# Altium schematic sheet RelayDriver.SchDoc
size A4 portrait; DateDraw: Date Draw; DateChecked: Date Review; Workspace: Workspace; TitleTyp: Title-Typ; PageSetup: Record=PageOptions|CenterHorizontal=True|CenterVertical=True|PrintScale=0.97|XCorrection=1.00|YCorrection=1.00|PrintKind=0|BorderSize=5000000|LeftOffset=0|BottomOffset=0|Orientation=2|PaperLength=1000|PaperWidth=1000|Scale=100|PaperSource=7|PrintQuality=-3|MediaType=1|DitherType=10|PrintScaleMode=1|PaperKind=A4|PaperIndex=9
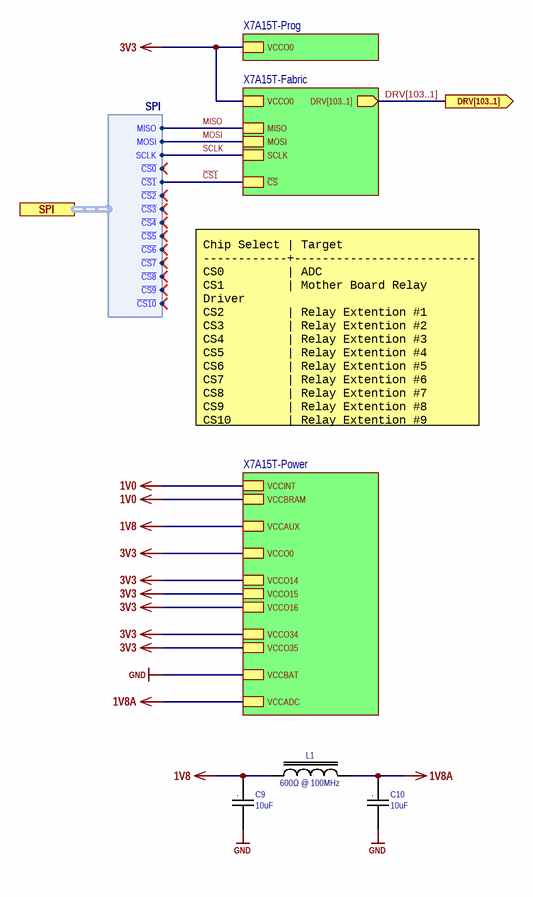
[diagram p0: RelayDriver.SchDoc]

## Parts
C9  value 10uF  [C0805 Reflow]  (hidden comment: C)
C10  value 10uF  [C0805 Reflow]  (hidden comment: C)
L1  Nominal Impedance: 600Ω @ 100MHz  [FB0805]  (hidden comment: L)

## Sub-sheets
X7A15T-Fabric = X7A15T-Fabric.SchDoc: SCLK, MISO, VCCO0, MOSI, ~{CS}, DRV[103..1] (out)
X7A15T-Power = X7A15T-Power.SchDoc: VCCADC, VCCO0, VCCO14, VCCO35, VCCO16, VCCAUX, VCCINT, VCCO34, VCCBRAM, VCCO15, VCCBAT
X7A15T-Prog = X7A15T-Prog.SchDoc: VCCO0

## Ports
DRV[103..1] (out), SPI (harness SPI)

## Harnesses
SPI: MISO, MOSI, SCLK, ~{CS0}, ~{CS1}, ~{CS2}, ~{CS3}, ~{CS4}, ~{CS5}, ~{CS6}, ~{CS7}, ~{CS8}, ~{CS9}, ~{CS10}

## Nets
1V0: sheet X7A15T-Power/VCCINT, sheet X7A15T-Power/VCCBRAM
1V8: C9.1 L1.1 ; sheet X7A15T-Power/VCCAUX
1V8A: C10.1 L1.2 ; sheet X7A15T-Power/VCCADC
3V3: sheet X7A15T-Prog/VCCO0, sheet X7A15T-Fabric/VCCO0, sheet X7A15T-Power/VCCO0, sheet X7A15T-Power/VCCO14, sheet X7A15T-Power/VCCO35, sheet X7A15T-Power/VCCO16, sheet X7A15T-Power/VCCO34, sheet X7A15T-Power/VCCO15
GND: C9.2 C10.2 ; sheet X7A15T-Power/VCCBAT
~{CS1}: sheet X7A15T-Fabric/~{CS}, port SPI.~{CS1}
MISO: sheet X7A15T-Fabric/MISO, port SPI.MISO
MOSI: sheet X7A15T-Fabric/MOSI, port SPI.MOSI
SCLK: sheet X7A15T-Fabric/SCLK, port SPI.SCLK

## Buses and harness runs
bus DRV[103..1] = port DRV[103..1] = sheet X7A15T-Fabric/DRV[103..1]

## Notes on the sheet
- Chip Select | Target
  ------------+--------------------------
  CS0         | ADC
  CS1         | Mother Board Relay Driver
  CS2         | Relay Extention #1
  CS3         | Relay Extention #2
  CS4         | Relay Extention #3
  CS5         | Relay Extention #4
  CS6         | Relay Extention #5
  CS7         | Relay Extention #6
  CS8         | Relay Extention #7
  CS9         | Relay Extention #8
  CS10        | Relay Extention #9
- designed by
- reviewed by
- last drawn by
- Project:
- Schematic:
- last printed
- DIN-A4 P
- sheets
- of
- File:
- (in symbol C) .

## Library data of the parts
C9 C10 = C: CAP CER 10UF 10V X7R 0805; 04. Manufacturer: Samsung Electro-Mechanics; 07. Manufacturer  Part Number: CL21B106KPQNNNE; Tolerance: ±10%; 03. Unit Price: 0.24; 13. Created Date/Name: AUG2018/Hören; Voltage Rating: 10V; Type: X7R; ComponentLink1Description: Info; ComponentLink1URL: https://www.digikey.de/products/en?keywords=1276-1764-6-ND; 02. Distributor Part Number: 1276-1764-6-ND; 09. Operating Temperature: -55°C ~ 125°C; 11. RoHS: YES; 01. Distributor: DigiKey; ComponentLink2Description: DataSheet; Package: 0805
L1 = FB: FERRITE BEAD 600 OHM 0805 1LN; 04. Manufacturer: Würth Elektronik; 07. Manufacturer  Part Number: 742792040; DCR: 150mΩ; Impedance Tolerance: %; 03. Unit Price: 0.22; 13. Created Date/Name: AUG2018/Hören; IRMS: 2A; ComponentLink1Description: Info; ComponentLink1URL: https://www.digikey.de/products/en?keywords=732-1620-6-ND; ComponentLink2Description: DataSheet; ComponentLink2URL: https://www.we-online.de/katalog/datasheet/742792040.pdf; 02. Distributor Part Number: 732-1620-6-ND; 09. Operating Temperature: -55°C ~ 125°C; 11. RoHS: YES; 01. Distributor: DigiKey; ISAT: *; Package: 0805; Tolerance: *; Value: *